# Altium schematic sheet audio.SchDoc
size A4
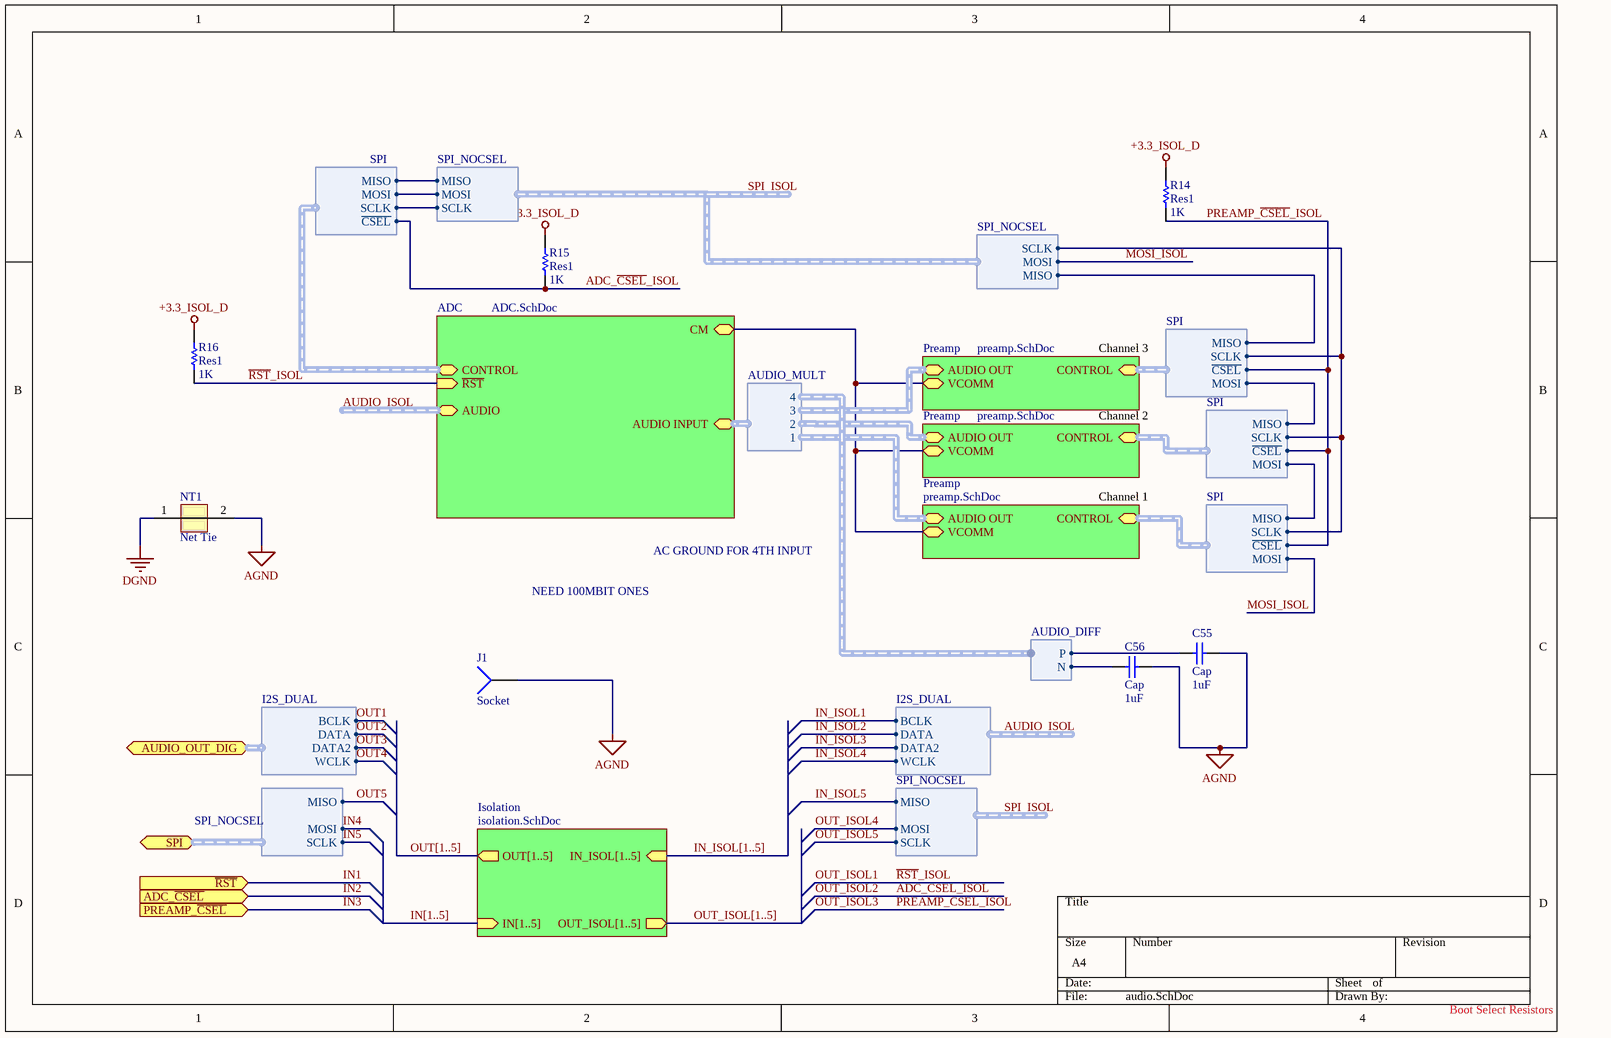
[diagram p0: audio.SchDoc]

## Parts
C55  Cap  value 1uF  [C0603]
C56  Cap  value 1uF  [C0603]
J1  Socket  [PIN1]
NT1  Net Tie  [NetTie]  (net tie, no BOM)
R14  Res1  value 1K  [R0603]
R15  Res1  value 1K  [R0603]
R16  Res1  value 1K  [R0603]

## Sub-sheets
ADC = ADC.SchDoc: CONTROL (harness SPI), ~{RST} (in), AUDIO (harness I2S_DUAL), AUDIO INPUT (harness AUDIO_MULT), CM
Isolation = isolation.SchDoc: OUT_ISOL[1..5] (out), OUT[1..5] (out), IN[1..5] (in), IN_ISOL[1..5] (in)
Preamp = preamp.SchDoc: CONTROL (harness SPI), AUDIO OUT (harness AUDIO_DIFF), VCOMM
Preamp = preamp.SchDoc: CONTROL (harness SPI), AUDIO OUT (harness AUDIO_DIFF), VCOMM
Preamp = preamp.SchDoc: CONTROL (harness SPI), AUDIO OUT (harness AUDIO_DIFF), VCOMM

## Ports
ADC_~{CSEL} (in), AUDIO_OUT_DIG (harness I2S_DUAL), PREAMP_~{CSEL} (in), SPI (harness SPI_NOCSEL), ~{RST} (in)

## Harnesses
AUDIO_MULT: 1, 2, 3, 4
SPI: ~{CSEL}, MISO, MOSI, SCLK
SPI_NOCSEL: MISO, MOSI, SCLK
I2S_DUAL: BCLK, DATA, DATA2, WCLK
AUDIO_DIFF: N, P

## Nets
+3.3_ISOL_D: R14.2 R15.2 R16.2
AGND: C55.1 C56.1 J1.1 NT1.2
DGND: NT1.1
ADC_~{CSEL}_ISOL: R15.1 ; sheet ADC/CONTROL.~{CSEL}  [also labelled OUT_ISOL2]
IN1: port ~{RST}
IN2: port ADC_~{CSEL}
IN3: port PREAMP_~{CSEL}
IN4: port SPI.MOSI
IN5: port SPI.SCLK
IN_ISOL1: sheet ADC/AUDIO.BCLK  [project net AUDIO_ISOL.BCLK]
IN_ISOL2: sheet ADC/AUDIO.DATA  [project net AUDIO_ISOL.DATA]
IN_ISOL3: sheet ADC/AUDIO.DATA2  [project net AUDIO_ISOL.DATA2]
IN_ISOL4: sheet ADC/AUDIO.WCLK  [project net AUDIO_ISOL.WCLK]
IN_ISOL5: sheet Preamp/CONTROL.MISO, sheet ADC/CONTROL.MISO, harness SPI_NOCSEL.MISO
MOSI_ISOL: sheet Preamp/CONTROL.MOSI, sheet ADC/CONTROL.MOSI, harness SPI_NOCSEL.MOSI  [also labelled OUT_ISOL4]
OUT1: port AUDIO_OUT_DIG.BCLK
OUT2: port AUDIO_OUT_DIG.DATA
OUT3: port AUDIO_OUT_DIG.DATA2
OUT4: port AUDIO_OUT_DIG.WCLK
OUT5: port SPI.MISO
OUT_ISOL1: R16.1 ; sheet ADC/~{RST}  [also labelled ~{RST}_ISOL]
OUT_ISOL3: R14.1 ; sheet Preamp/CONTROL.~{CSEL}  [also labelled PREAMP_~{CSEL}_ISOL]
OUT_ISOL5: sheet Preamp/CONTROL.SCLK, sheet ADC/CONTROL.SCLK, harness SPI_NOCSEL.SCLK
NetC55_2: C55.2 ; harness AUDIO_DIFF.P
NetC56_2: C56.2 ; harness AUDIO_DIFF.N
(unnamed): sheet Preamp/VCOMM, sheet ADC/CM, sheet Preamp/VCOMM, sheet Preamp/VCOMM
(unnamed): sheet Preamp/CONTROL.MOSI, sheet Preamp/CONTROL.MISO
(unnamed): sheet Preamp/CONTROL.MOSI, sheet Preamp/CONTROL.MISO

## Buses and harness runs
bus IN[1..5] = sheet Isolation/IN[1..5]
bus IN_ISOL[1..5] = sheet Isolation/IN_ISOL[1..5]
bus OUT[1..5] = sheet Isolation/OUT[1..5]
bus OUT_ISOL[1..5] = sheet Isolation/OUT_ISOL[1..5]
harness AUDIO_ISOL = sheet ADC/AUDIO

## Notes on the sheet
- Channel 3
- Channel 2
- Channel 1
- AC GROUND FOR 4TH INPUT
- NEED 100MBIT ONES
- Boot Select Resistors

## Library data of the parts
C55 C56 = Cap: Capacitor; Published: 8-Jun-2000; LatestRevisionDate: 17-Jul-2002; LatestRevisionNote: Re-released for DXP Platform.; PackageReference: RAD-0.3; Publisher: Altium Limited
NT1 = NetTie
R14-R16 = Res1: Resistor; Published: 8-Jun-2000; LatestRevisionDate: 17-Jul-2002; LatestRevisionNote: Re-released for DXP Platform.; PackageReference: AXIAL-0.3; Publisher: Altium Limited
J1 = Socket: LatestRevisionDate: 17-Jul-2002; LatestRevisionNote: Re-released for DXP Platform.; Publisher: Altium Limited